# Altium schematic sheet InterfaceDataTelemetrie.SchDoc
size A3; Organization: Altium Limited; Address1: Laboratoire de Systèmes Embarqués; Address2: 7, rue de la Serre; Address3: 2610 Saint-Imier / Switzerland; PageSetup: Record=PageOptions|CenterHorizontal=True|CenterVertical=True|PrintScale=0.24|XCorrection=1.00|YCorrection=1.00|PrintKind=0|BorderSize=5000000|LeftOffset=0|BottomOffset=0|Orientation=2|PaperLength=1000|PaperWidth=1000|Scale=100|PaperSource=7|PrintQuality=-4|MediaType=1|DitherType=10|PaperKind=A4|PrintScaleMode=1
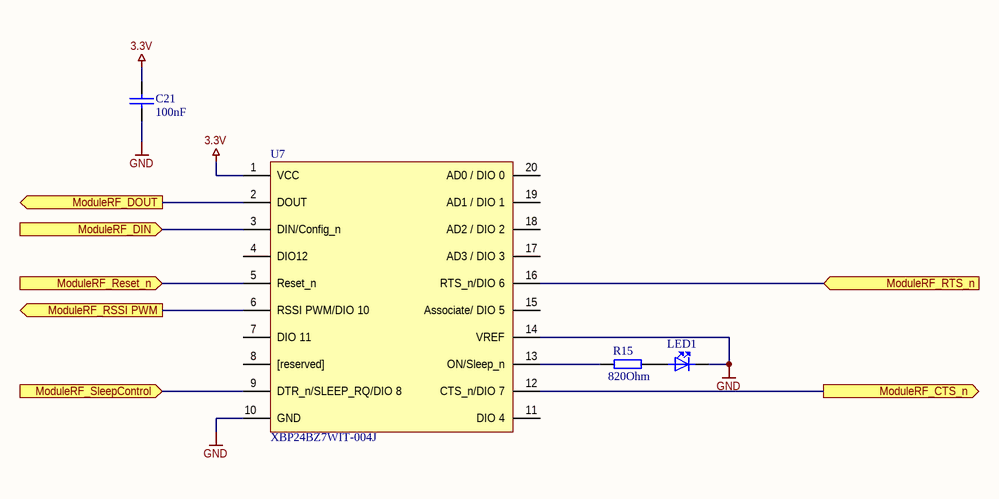
[diagram p0: InterfaceDataTelemetrie.SchDoc]

## Parts
C21  value 100nF  [060301]  (hidden comment: GRM188R71E104KA01D)
LED1  LG L29K-G2J1-24-Z  [060301_led]  (value not drawn)
R15  value 820Ohm  [080501]  (hidden comment: RMCF0805JT820R)
U7  XBP24BZ7WIT-004J  [XBee-Pro]

## Ports
ModuleRF_CTS_n (out), ModuleRF_DIN (in), ModuleRF_DOUT (out), ModuleRF_Reset_n (in), ModuleRF_RSSI PWM (out), ModuleRF_RTS_n (in), ModuleRF_SleepControl (in)

## Nets
3.3V: C21.1 U7.1(VCC)
GND: C21.2 LED1.2(CATHODE) U7.10(GND) U7.14(VREF)
ModuleRF_CTS_n: U7.12(CTS_n/DIO_7) ; port ModuleRF_CTS_n
ModuleRF_DIN: U7.3(DIN/Config_n) ; port ModuleRF_DIN
ModuleRF_DOUT: U7.2(DOUT) ; port ModuleRF_DOUT
ModuleRF_Reset_n: U7.5(Reset_n) ; port ModuleRF_Reset_n
ModuleRF_RSSI PWM: U7.6(RSSI_PWM/DIO_10) ; port ModuleRF_RSSI PWM
ModuleRF_RTS_n: U7.16(RTS_n/DIO_6) ; port ModuleRF_RTS_n
ModuleRF_SleepControl: U7.9(DTR_n/SLEEP_RQ/DIO_8) ; port ModuleRF_SleepControl
NetLED1_1: LED1.1(ANODE) R15.2
NetR15_1: R15.1 U7.13(ON/Sleep_n)

Not connected (* = marked no-connect by the designer): U7 4(DIO12) 7(DIO_11) 8([reserved]) 11(DIO_4) 15(Associate/_DIO_5) 17(AD3_/_DIO_3) 18(AD2_/_DIO_2) 19(AD1_/_DIO_1) 20(AD0_/_DIO_0)

## Notes on the sheet
- Title
- Size:
- Date:
- A3
- Author:
- Time:
- Revision:
- Sheet
- of
- File:

## Library data of the parts
C21 = CAPA: EtatCommande: Interne; Text Field1: CAPA; Supplier 1: Digi-Key; Supplier Part Number 1: 490-1524-1-ND
LED1 = LED: EtatCommande: Commandé; Supplier 1: Digi-Key; Supplier Part Number 1: 475-2709-1-ND; Text Field1: LED
R15 = RES: Text Field1: RESISTANCE; EtatCommande: Interne; Supplier 1: Digi-Key; Supplier Part Number 1: RMCF0805JT820RDKR-ND
U7 = MaxStream XBee-PRO: EtatCommande: Commandé; Supplier 1: Mouser; Supplier Part Number 1: 888-XBP24BZ7WIT-004J